# Altium schematic sheet 1_Power Management.schdoc.schdoc
size 495 x 241 mm; Name: A_A4; Symbol: A_A4; Device: A_A4; @Project Name: Радіо-пристрій Urobo 02; REV: 1.0; Date: 2023-10-07; Sheet: 1/2; Draw By: Nircus; Company: Urobo; Convert to PCB: yes; Add into BOM: yes
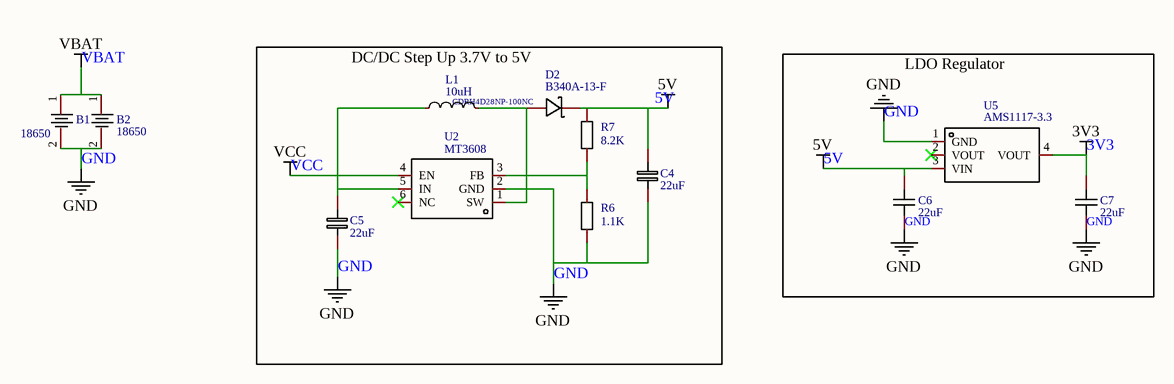
[diagram p0: 1_Power Management.schdoc.schdoc]

## Parts
B1  18650  [18650]
B2  18650  [18650]
C4  22uF  [C1206]
C5  22uF  [C1206]
C6  22uF  [C1206]
C7  22uF  [C1206]
D2  B340A-13-F  [SMA_L4.4-W2.6-LS5.0-RD]
L1  10uH  [IND-SMD_L4.7-W4.7]
R6  1.1K  [R0805]
R7  8.2K  [R0805]
U2  MT3608  [SOT-23-6_L2.9-W1.6-P0.95-LS2.8-BL]
U5  AMS1117-3.3  [SOT-223-3_L6.4-W3.5-P2.30-LS7.0-BR]

## Blocks framed on the sheet
DC/DC Step Up 3.7V to 5V: C4 C5 D2 L1 R6 R7 U2
LDO Regulator: C6 C7 U5

## Nets
3V3: C7.2 U5.4(VOUT)
5V: C4.2 C6.2 D2.1(K) R7.2 U5.3(VIN)
GND: B1.2 B2.2 C4.1 C5.1 C6.1 C7.1 R6.1 U2.2(GND) U5.1(GND)
VBAT: B1.1 B2.1
VCC: C5.2 L1.1 U2.4(EN) U2.5(IN)
NetD2_2: D2.2(A) L1.2 U2.1(SW)
NetR6_2: R6.2 R7.1 U2.3(FB)

Not connected (* = marked no-connect by the designer): U2 6(NC)*; U5 2(VOUT)*

## Notes on the sheet
- 1
- 2
- 3
- 4
- 5
- A
- B
- C
- D
- TITLE:
- Радіо-пристрій Urobo 02
- REV:
- 1.0
- Date:
- Company:
- 2023-10-07
- Urobo
- Drawn By:
- Nircus
- Sheet:
- 1/2

## Library data of the parts
B1 B2 = CR1220-2: Manufacturer: Q&amp;J; Convert to PCB: yes; Name: 18650; Symbol: CR1220-2; Device: CR1220-2; Supplier: LCSC; Manufacturer Part: CR1220-2; image: //image.lceda.cn/szlcsc/C70381.jpg; Supplier Part: C70381; Add into BOM: yes; Origin Footprint: 18650
C4-C7 = 1206X226M250NT: Capacitance: Voltage Rated:; Manufacturer: FH(风华); Add into BOM: yes; Name: 22uF; Symbol: 22uF; Device: 1206X226M250NT; LCSC Part Name: 22uF 25V; Supplier Part: C2858005; Manufacturer Part: 1206X226M250NT; Supplier Footprint: 1206; JLCPCB Part Class: Extended Part; Datasheet: https://atta.szlcsc.com/upload/public/pdf/source/20200305/C486355_26A10D38EF8C2A5C37091D0039909270.pdf; Supplier: LCSC; Convert to PCB: yes; Value: 22uF; Origin Footprint: C1206
  C6 C7: link: https://lcsc.com/eda_search?q=C541523&amp;%26type=1&amp;ref=editor
D2 = B340A-13-F: Reverse Voltage (Vr):40V Average Rectified Current (Io):3A Forward Voltage (Vf@If):500mV@3A; Manufacturer: DIODES(美台); Add into BOM: yes; Reverse Voltage (Vr): 40V; Average Rectified Current (Io): 3A; Name: B340A-13-F; Symbol: B340A-13-F; Device: B340A-13-F; LCSC Part Name: 40V 3A 500mV@3A; Supplier Part: C85098; Manufacturer Part: B340A-13-F; Supplier Footprint: SMA(DO-214AC); JLCPCB Part Class: Extended Part; Datasheet: https://atta.szlcsc.com/upload/public/pdf/source/20171023/C134454_15087453575121052549.pdf; Supplier: LCSC; Convert to PCB: yes; Forward Voltage (Vf@If): 500mV@3A; Origin Footprint: SMA_L4.4-W2.6-LS5.0-RD; link: https://lcsc.com/eda_search?q=C85098&amp;%26type=1&amp;ref=editor
L1 = CDRH4D28NP-100NC: Inductance: Tolerance:±30% Tolerance:±30% Rated Current: DC Resistance (DCR):; Manufacturer: Sumida(胜美达); Add into BOM: yes; Tolerance: ±30%; Origin Footprint: IND-SMD_L4.7-W4.7_CDRH4D28NP; Name: 10uH; Symbol: 10uH; Device: CDRH4D28NP-100NC; LCSC Part Name: 10uH ±30% 1A 95mΩ; Supplier Part: C350665; Manufacturer Part: CDRH4D28NP-100NC; Supplier Footprint: SMD; JLCPCB Part Class: Extended Part; Datasheet: https://atta.szlcsc.com/upload/public/pdf/source/20181213/C350665_248F139205FB3D79AA431DED0AD8C55C.pdf; Supplier: LCSC; Convert to PCB: yes; Value: 10uH
R6 R7 = Res_0603: Symbol: Res; Convert to PCB: yes; Device: Res_0603; Add into BOM: yes; Supplier Footprint: 0603
  R6: Name: 1.1K; Value: 1.1K; Supplier Part: C473284
  R7: Name: 8.2K; Value: 8.2K; Supplier Part: C101875
U2 = MT3608: Function:boost converterType Synchronous Rectification:- Number of Outputs:1 Topology:Boost Input Voltage:2V~24V Input Voltage:2V~24V Output Voltage:28V Output Voltage:28V Output Current (Max):- Switching Frequency:1.2MHz; Manufacturer: 西安航天民芯; Add into BOM: yes; Number of Outputs: 1; Topology: Boost; Input Voltage: 2V~24V; Output Voltage: 28V; Switching Frequency: 1.2MHz; Name: MT3608; Symbol: MT3608; Device: MT3608; LCSC Part Name: 升压型 输入2V~24V 输出28V; Supplier Part: C84817; Manufacturer Part: MT3608; Supplier Footprint: SOT-23-6; JLCPCB Part Class: Extended Part; Datasheet: https://atta.szlcsc.com/upload/public/pdf/source/20161110/1478743351706.pdf; Supplier: LCSC; Convert to PCB: yes; Function: boost converterType; Synchronous Rectification: -; Output Current (Max): -; Origin Footprint: SOT-23-6_L2.9-W1.6-P0.95-LS2.8-BL; link: https://lcsc.com/eda_search?q=C84817&amp;%26type=1&amp;ref=editor
U5 = AMS1117-3.3: Manufacturer: 国芯佳品; Add into BOM: yes; Origin Footprint: SOT-223-3_L6.5-W3.4-P2.30-LS7.0-BR; Name: AMS1117-3.3; Symbol: AMS1117-3.3; Device: AMS1117-3.3; LCSC Part Name: AMS1117-3.3; Supplier Part: C2992570; Manufacturer Part: AMS1117-3.3; Supplier Footprint: SOT-223-3; JLCPCB Part Class: Extended Part; Datasheet: https://atta.szlcsc.com/upload/public/pdf/source/20220729/0D21C21EC310E4778671BF6BAE438640.pdf; Supplier: LCSC; Convert to PCB: yes; link: https://lcsc.com/eda_search?q=C6186&amp;%26type=1&amp;ref=editor